# Altium schematic sheet main.SchDoc: 13.56MHz AM-transmitter
size A4; Engineer: CT; SheetNumber: 1; SheetTotal: 2
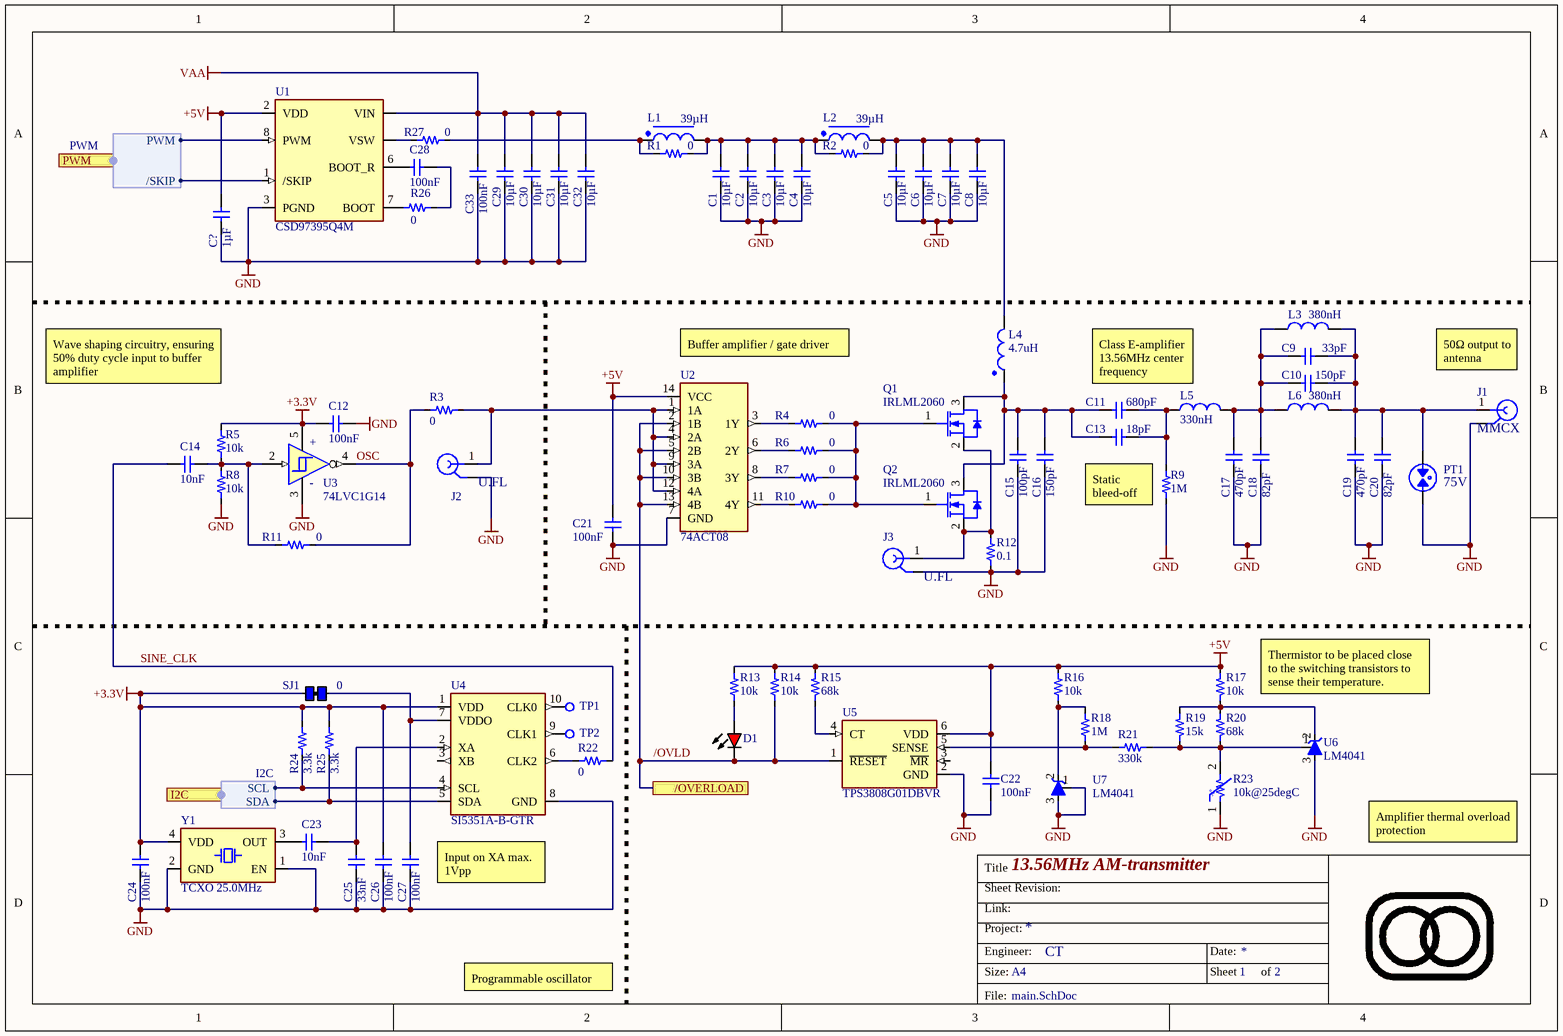
[diagram p0: main.SchDoc]

## Parts
C1  value 10µF  [WCAP-CSGP_1210_L3.2W2.5H2.5]  (hidden comment: Capacitor 10µF +/-10% 50V X7R 1210)
C2  value 10µF  [WCAP-CSGP_1210_L3.2W2.5H2.5]  (hidden comment: Capacitor 10µF +/-10% 50V X7R 1210)
C3  value 10µF  [WCAP-CSGP_1210_L3.2W2.5H2.5]  (hidden comment: Capacitor 10µF +/-10% 50V X7R 1210)
C4  value 10µF  [WCAP-CSGP_1210_L3.2W2.5H2.5]  (hidden comment: Capacitor 10µF +/-10% 50V X7R 1210)
C5  value 10µF  [WCAP-CSGP_1210_L3.2W2.5H2.5]  (hidden comment: Capacitor 10µF +/-10% 50V X7R 1210)
C6  value 10µF  [WCAP-CSGP_1210_L3.2W2.5H2.5]  (hidden comment: Capacitor 10µF +/-10% 50V X7R 1210)
C7  value 10µF  [WCAP-CSGP_1210_L3.2W2.5H2.5]  (hidden comment: Capacitor 10µF +/-10% 50V X7R 1210)
C8  value 10µF  [WCAP-CSGP_1210_L3.2W2.5H2.5]  (hidden comment: Capacitor 10µF +/-10% 50V X7R 1210)
C9  value 33pF  [1206-C-L]  (hidden comment: Capacitor 33pF +/-5% 50V NP0 1206)
C10  value 150pF  [1206-C-N]  (hidden comment: Capacitor 150pF +/-5% 100V NP0 1206)
C11  value 680pF  [1206-C-L]  (hidden comment: Capacitor 680pF +/-5% 100V NP0 1206)
C12  value 100nF  [0603-C-N]  (hidden comment: Capacitor 100nF +/-10% 50V X7R 0603)
C13  value 18pF  [1206-C-N]  (hidden comment: CC1206JKNPOCBN180)
C14  value 10nF  [0603-C-N]  (hidden comment: Capacitor 10nF 50V NP0 0603)
C15  value 100pF  [1206-C-N]  (hidden comment: Capacitor 100pF +/-5% 630V NP0 Class I 1206)
C16  value 150pF  [1206-C-N]  (hidden comment: Capacitor 150pF +/-5% 100V NP0 1206)
C17  value 470pF  [1206-C-L]  (hidden comment: Capacitor 470pF +/-5% 100V NP0 1206)
C18  value 82pF  [1206-C-N]  (hidden comment: 1206N820J102CT)
C19  value 470pF  [1206-C-L]  (hidden comment: Capacitor 470pF +/-5% 100V NP0 1206)
C20  value 82pF  [1206-C-N]  (hidden comment: 1206N820J102CT)
C21  value 100nF  [0603-C-N]  (hidden comment: Capacitor 100nF +/-10% 50V X7R 0603)
C22  value 100nF  [0603-C-N]  (hidden comment: Capacitor 100nF +/-10% 50V X7R 0603)
C23  value 10nF  [0603-C-N]  (hidden comment: Capacitor 10nF 50V NP0 0603)
C24  value 100nF  [0603-C-N]  (hidden comment: Capacitor 100nF +/-10% 50V X7R 0603)
C25  value 33nF  [1206-C-L]  (hidden comment: Capacitor 33nF +/-5% 10V NP0 1206)
C26  value 100nF  [0603-C-N]  (hidden comment: Capacitor 100nF +/-10% 50V X7R 0603)
C27  value 100nF  [0603-C-N]  (hidden comment: Capacitor 100nF +/-10% 50V X7R 0603)
C28  value 100nF  [0603-C-N]  (hidden comment: Capacitor 100nF +/-10% 50V X7R 0603)
C29  value 10µF  [WCAP-CSGP_1210_L3.2W2.5H2.5]  (hidden comment: Capacitor 10µF +/-10% 50V X7R 1210)
C30  value 10µF  [WCAP-CSGP_1210_L3.2W2.5H2.5]  (hidden comment: Capacitor 10µF +/-10% 50V X7R 1210)
C31  value 10µF  [WCAP-CSGP_1210_L3.2W2.5H2.5]  (hidden comment: Capacitor 10µF +/-10% 50V X7R 1210)
C32  value 10µF  [WCAP-CSGP_1210_L3.2W2.5H2.5]  (hidden comment: Capacitor 10µF +/-10% 50V X7R 1210)
C33  value 100nF  [0603-C-N]  (hidden comment: Capacitor 100nF +/-10% 50V X7R 0603)
C?  value 1µF  [1206-C-N]  (hidden comment: Capacitor 1µF +/-10% 50V X7R 1206)
D1  150060RS86000  [WL-SMCW_0603_150060xx8x000]  (value not drawn)
J1  66011002111501  [66011002111501]  (value not drawn)
J2  U.FL-R-SMT(10)  [HRS-U.FL-R-SMT_V]  (value not drawn)
J3  U.FL-R-SMT(10)  [HRS-U.FL-R-SMT_V]  (value not drawn)
L1  Inductance: 39µH  [WE-PD2_1054]  (hidden comment: 744776139)
L2  Inductance: 39µH  [WE-PD2_1054]  (hidden comment: 744776139)
L3  Inductance: 380nH  [WE-CAIR_5910]  (hidden comment: 744918238)
L4  Inductance: 4.7uH  [WE-PDA_1260]  (hidden comment: 784771047)
L5  value 330nH  [IND_2929SQ-331]  (hidden comment: 2929SQ-331GEC)
L6  Inductance: 380nH  [WE-CAIR_5910]  (hidden comment: 744918238)
PT1  GTCC23-750M-R01-2  [GDT_4532]  (value not drawn)
Q1  value IRLML2060  [SOT-23-3-N]  (hidden comment: IRLML2060TRPBF)
Q2  value IRLML2060  [SOT-23-3-N]  (hidden comment: IRLML2060TRPBF)
R1  value 0  [1206-R-N]  (hidden comment: Jumper 0R <50 mOhm 2A 1206)
R2  value 0  [1206-R-N]  (hidden comment: Jumper 0R <50 mOhm 2A 1206)
R3  value 0  [0603-R-N]  (hidden comment: Jumper 0R <50 mOhm 1A 0603)
R4  value 0  [0603-R-N]  (hidden comment: Jumper 0R <50 mOhm 1A 0603)
R5  value 10k  [0603-R-N]  (hidden comment: Resistor 10k +/-1% 50V 0603)
R6  value 0  [0603-R-N]  (hidden comment: Jumper 0R <50 mOhm 1A 0603)
R7  value 0  [0603-R-N]  (hidden comment: Jumper 0R <50 mOhm 1A 0603)
R8  value 10k  [0603-R-N]  (hidden comment: Resistor 10k +/-1% 50V 0603)
R9  value 1M  [1206-R-N]  (hidden comment: CRG1206F1M0)
R10  value 0  [0603-R-N]  (hidden comment: Jumper 0R <50 mOhm 1A 0603)
R11  value 0  [0603-R-N]  (hidden comment: Jumper 0R <50 mOhm 1A 0603)
R12  value 0.1  [1206-R-N]  (hidden comment: Resistor 0.1R +/-1% 0.5W 1206)
R13  value 10k  [0603-R-N]  (hidden comment: Resistor 10k +/-1% 50V 0603)
R14  value 10k  [0603-R-N]  (hidden comment: Resistor 10k +/-1% 50V 0603)
R15  value 68k  [0603-R-N]  (hidden comment: Resistor 68k +/-1% 50V 0603)
R16  value 10k  [0603-R-N]  (hidden comment: Resistor 10k +/-1% 50V 0603)
R17  value 10k  [0603-R-N]  (hidden comment: Resistor 10k +/-1% 50V 0603)
R18  value 1M  [0603-R-N]  (hidden comment: Resistor 1M +/-1% 50V 0603)
R19  value 15k  [0603-R-N]  (hidden comment: Resistor 15k +/-1% 50V 0603)
R20  value 68k  [0603-R-N]  (hidden comment: Resistor 68k +/-1% 50V 0603)
R21  value 330k  [0603-R-N]  (hidden comment: Resistor 330k +/-1% 50V 0603)
R22  value 0  [0603-R-N]  (hidden comment: Jumper 0R <50 mOhm 1A 0603)
R23  value 10k@25degC  [0603-R-N]  (hidden comment: NCP18XH103F03RB)
R24  value 3.3k  [0603-R-N]  (hidden comment: Resistor 3.3k +/-1% 50V 0603)
R25  value 3.3k  [0603-R-N]  (hidden comment: Resistor 3.3k +/-1% 50V 0603)
R26  value 0  [0603-R-N]  (hidden comment: Jumper 0R <50 mOhm 1A 0603)
R27  value 0  [1206-R-N]  (hidden comment: Jumper 0R <50 mOhm 2A 1206)
SJ1  value 0  [SJ_0603_1A]  (hidden comment: SJ-0603-1A)  (net tie, no BOM)
TP1  Testpad with multiple sizes  [TP_1.5mm]  (value not drawn)  (no BOM)
TP2  Testpad with multiple sizes  [TP_1.5mm]  (value not drawn)  (no BOM)
U1  CSD97395Q4M  [SON40P350X450X100-8N]
U2  value 74ACT08  [SOIC14-N]  (hidden comment: MC74ACT08DR2G)
U3  value 74LVC1G14  [SOT25-N]  (hidden comment: SN74LVC1G14DBVR)
U4  SI5351A-B-GTR  [VSSOP10-N]
U5  TPS3808G01DBVR  [SOT-23-6]
U6  value LM4041  [SOT-23-3-N]  (hidden comment: LM4041DIM3X-ADJ/NOPB)
U7  value LM4041  [SOT-23-3-N]  (hidden comment: LM4041DIM3X-ADJ/NOPB)
Y1  value TCXO 25.0MHz  [WE-SPXO_IQXO-791]  (hidden comment: SX2T25.000B010J020S)

## Ports
/OVERLOAD, I2C (harness I2C), PWM (harness PWM)

## Harnesses
I2C: SDA, SCL
PWM: PWM, /SKIP

## Nets
+3.3V: C12.2 C24.1 C26.1 R5.1 R24.2 R25.2 SJ1.1(L) U3.5(VCC) U4.1(VDD) Y1.4(VDD)
+5V: C21.2 C22.2 C?.2 R13.2 R14.2 R15.1 R16.2 R17.2 U1.2(VDD) U2.14(VCC) U5.6(VDD)
GND: C1.1 C2.1 C3.1 C4.1 C5.1 C6.1 C7.1 C8.1 C12.1 C15.1 C16.1 C17.1 C18.1 C19.1 C20.1 C21.1 C22.1 C24.2 C25.1 C26.2 C27.2 C29.1 C30.1 C31.1 C32.1 C33.2 C?.1 J1.2(GND) J2.2(GND) J3.2(GND) PT1.2 R8.2 R9.1 R12.2 R23.1 U1.3(PGND) U2.7(GND) U3.3(GND) U4.8(GND) U5.2(GND) U6.3(A) U7.1(rEF) U7.3(A) Y1.1(EN) Y1.2(GND)
VAA: C29.2 C30.2 C31.2 C32.2 C33.1 U1.5(VIN)
/OVLD: D1.1(K) R14.1 U2.2(1B) U2.5(2B) U2.10(3B) U2.13(4B) U5.1(~{RESET}) ; port /OVERLOAD
OSC: R3.2 R11.2 U3.4(Y)
SINE_CLK: C14.1 R22.1
NetC1_2: C1.2 C2.2 C3.2 C4.2 L1.2 L2.1 R1.2 R2.1
NetC5_2: C5.2 C6.2 C7.2 C8.2 L2.2 L4.2 R2.2
NetC9_1: C9.1 C10.2 C17.2 C18.2 L3.1 L5.2 L6.1
NetC9_2: C9.2 C10.1 C19.2 C20.2 J1.1(SIG) L3.2 L6.2 PT1.1
NetC11_1: C11.1 C13.1 C15.2 C16.2 L4.1 Q1.3(D) Q2.3(D)
NetC11_2: C11.2 C13.2 L5.1 R9.2
NetC14_2: C14.2 R5.2 R8.1 R11.1 U3.2(A)
NetC23_1: C23.1 Y1.3(OUT)
NetC23_2: C23.2 C25.2 U4.2(XA)
NetC27_1: C27.1 SJ1.2(R) U4.7(VDDO)
NetC28_1: C28.1 R26.1
NetC28_2: C28.2 U1.6(BOOT_R)
NetD1_2: D1.2(A) R13.1
NetJ2_1: J2.1(SIG) R3.1 U2.1(1A) U2.4(2A) U2.9(3A) U2.12(4A)
NetJ3_1: J3.1(SIG) Q1.2(S) Q2.2(S) R12.1
NetL1_1: L1.1 R1.1 R27.2
NetQ1_1: Q1.1(G) Q2.1(G) R4.2 R6.2 R7.2 R10.2
NetR4_1: R4.1 U2.3(1Y)
NetR6_1: R6.1 U2.6(2Y)
NetR7_1: R7.1 U2.8(3Y)
NetR10_1: R10.1 U2.11(4Y)
NetR15_2: R15.2 U5.4(CT)
NetR16_1: R16.1 R18.2 U7.2(C)
NetR17_1: R17.1 R19.2 R20.2 U6.2(C)
NetR18_1: R18.1 R21.1 U5.5(SENSE)
NetR19_1: R19.1 R20.1 R21.2 R23.2 U6.1(rEF)
NetR22_2: R22.2 U4.6(CLK2)
NetR24_1: R24.1 U4.4(SCL) ; port I2C.SCL
NetR25_1: R25.1 U4.5(SDA) ; port I2C.SDA
NetR26_2: R26.2 U1.7(BOOT)
NetR27_1: R27.1 U1.4(VSW)
NetTP1_1: TP1.1(Pad) U4.10(CLK0)
NetTP2_1: TP2.1(Pad) U4.9(CLK1)
NetU1_1: U1.1(/SKIP) ; port PWM./SKIP
NetU1_8: U1.8(PWM) ; port PWM.PWM

Not connected (* = marked no-connect by the designer): U4 3(XB); U5 3(~{MR})

## Notes on the sheet
- (near R5) Wave shaping circuitry, ensuring 50% duty cycle input to buffer amplifier
- (near U2) Buffer amplifier / gate driver
- Class E-amplifier
  13.56MHz center frequency
- (near J1) 50Ω output to antenna
- (near R9) Static bleed-off
- Thermistor to be placed close  to the switching transistors to sense their temperature.
- Amplifier thermal overload protection
- Input on XA max. 1Vpp
- Programmable oscillator
- Title
- Sheet Revision:
- Link:
- Size:
- Project:
- Engineer:
- A4
- Date:
- Sheet
- of
- File:
- (in symbol CMP-010-00032-13) -t°
- (in symbol CMP-016-00025-4) +; -

## Library data of the parts
C1-C8 C29-C32 = CMP-072-000922-14: WCAP-CSGP Multilayer Ceramic Chip Capacitor, General Purpose, size 1210, X7R, 10µF, 50VDC; Tolerance: 10%; Technical Reference: X7R1210106K050DFCT10000; Insulation Resistance: 0.01GO; Capacitor Type: MLCC; ComponentLink2URL: https://www.we-online.com/redexpert/spec/885012209073?ad; ComponentLink1URL: https://www.we-online.com/redexpert/article/885012209073?ad; Source: WCAP-CSGP.SchLib; Case/Package: 1210; Packaging: Tape and Reel; ComponentLink1Description: Website Link; Pins: 2; Width: 2.5mm; Voltage Rating: 50V; ComponentLink2Description: Datasheet Link; Match Code: WCAP-CSGP; Max Operating Temperature: 125°C; Usage: General Purpose; JLCPCB Part #: C2918502; Height: 2.5mm; Dielectric: X7R; Dissipation Factor: 10%; Length: 3.2mm; Min Operating Temperature: -55°C; Design Item ID: 885012209073; Mounting Technology: SMT
C9 = CMP-072-000282-13: WCAP-CSGP Multilayer Ceramic Chip Capacitor, General Purpose, size 1206, NP0, 33pF, 50VDC; Insulation Resistance: 10GO; Q Factor: 1000; Tolerance: 5%; Technical Reference: NP01206330J050DFCT10000; Capacitor Type: MLCC; Pins: 2; Length: 3.2mm; Usage: General Purpose; ComponentLink2Description: Datasheet Link; ComponentLink2URL: https://www.we-online.com/redexpert/spec/885012008040?ad; Design Item ID: 885012008040; Match Code: WCAP-CSGP; Width: 1.6mm; Max Operating Temperature: 125°C; Packaging: Tape and Reel; Voltage Rating: 50V; Min Operating Temperature: -55°C; Mounting Technology: SMT; Height: 0.8mm; Dielectric: NP0; Source: WCAP-CSGP.SchLib; Case/Package: 1206; ComponentLink1Description: Website Link; ComponentLink1URL: https://www.we-online.com/redexpert/article/885012008040?ad
C10 C16 = CMP-072-000302-14: WCAP-CSGP Multilayer Ceramic Chip Capacitor, General Purpose, size 1206, NP0, 150pF, 100VDC; Q Factor: 1000; Insulation Resistance: 10GO; Capacitor Type: MLCC; Tolerance: 5%; Technical Reference: NP01206151J100DFCT10000; Packaging: Tape and Reel; Dielectric: NP0; Voltage Rating: 100V; Min Operating Temperature: -55°C; ComponentLink1URL: https://www.we-online.com/redexpert/article/885012008068?ad; Length: 3.2mm; Source: WCAP-CSGP.SchLib; ComponentLink1Description: Website Link; Design Item ID: 885012008068; Mounting Technology: SMT; Pins: 2; Max Operating Temperature: 125°C; JLCPCB Part #: C162445; Height: 0.8mm; Usage: General Purpose; ComponentLink2Description: Datasheet Link; Width: 1.6mm; ComponentLink2URL: https://www.we-online.com/redexpert/spec/885012008068?ad; Match Code: WCAP-CSGP; Case/Package: 1206
C11 = CMP-072-000305-14: WCAP-CSGP Multilayer Ceramic Chip Capacitor, General Purpose, size 1206, NP0, 680pF, 100VDC; Technical Reference: NP01206681J100DFCT10000; Tolerance: 5%; Insulation Resistance: 10GO; Capacitor Type: MLCC; Q Factor: 1000; Mounting Technology: SMT; Case/Package: 1206; Min Operating Temperature: -55°C; Packaging: Tape and Reel; ComponentLink1URL: https://www.we-online.com/redexpert/article/885012008072?ad; ComponentLink1Description: Website Link; Pins: 2; ComponentLink2Description: Datasheet Link; Max Operating Temperature: 125°C; Width: 1.6mm; Design Item ID: 885012008072; Source: WCAP-CSGP.SchLib; Height: 0.8mm; Match Code: WCAP-CSGP; Usage: General Purpose; Voltage Rating: 100V; Dielectric: NP0; Length: 3.2mm; ComponentLink2URL: https://www.we-online.com/redexpert/spec/885012008072?ad; JLCPCB Part #: C541497
C12 C21 C22 C24 C26-C28 C33 = CMP-072-000619-14: WCAP-CSGP Multilayer Ceramic Chip Capacitor, General Purpose, size 0603, X7R, 100nF, 50VDC; Dissipation Factor: 3%; Tolerance: 10%; Capacitor Type: MLCC; Insulation Resistance: 5GO; Technical Reference: X7R0603104K050DFCT10000; ComponentLink2Description: Datasheet Link; Dielectric: X7R; ComponentLink2URL: https://www.we-online.com/redexpert/spec/885012206095?ad; Case/Package: 0603; Voltage Rating: 50V; Height: 0.8mm; JLCPCB Part #: C14663; Design Item ID: 885012206095; Pins: 2; Min Operating Temperature: -55°C; Max Operating Temperature: 125°C; Width: 0.8mm; ComponentLink1URL: https://www.we-online.com/redexpert/article/885012206095?ad; Match Code: WCAP-CSGP; Packaging: Tape and Reel; Source: WCAP-CSGP.SchLib; Usage: General Purpose; Length: 1.6mm; ComponentLink1Description: Website Link; Mounting Technology: SMT
C13 = CMP-001-00140-1: Surface Mount Ceramic Multilayer Capacitor 18pF 5% C0G 1kV 1206 Blister T/R; RoHS Compliant: Yes; Min Operating Temperature: -55°C; Width: 0.063inch; Tolerance: 5%; Max Operating Temperature: 125°C; Case/Package: 1206; Thickness: 0.057inch; Voltage Rating: 1kV; Series: CC; Packaging: Tape and Reel; JLCPCB Part #: CC1206JKNPOCBN180; Mounting Technology: Surface Mount; Length: 0.126inch
C14 C23 = CMP-001-00137-5: Multilayer Ceramic Capacitor, Grm Series, 0.01 F, 5%, C0g / Np0, 50 V, 0603 [1608 Metric]; FLIR Part #: YCAM10N-7; Temperature Coefficient: 30ppm/°C; Reach SVHC Compliant: No; Case/Package: 0603; Thickness: 0.035inch; Width: 0.8mm; Case Code (Metric): 1608; Termination: SMD/SMT; Min Operating Temperature: -55°C; Voltage Rating (DC): 50V; Mounting Technology: Surface Mount; Package Quantity: 4000; Depth: 0.8mm; Dielectric: C0G; Packaging: Cut Tape; Voltage: 50V; Max Operating Temperature: 125°C; RoHS Compliant: Yes; Material: Ceramic; Lead Pitch: 0.5mm; Case Code (Imperial): 0603; Tolerance: 5%; Voltage Rating: 50V; Lead Free: Lead Free; Height: 0.8mm; Length: 1.6mm; JLCPCB Part #: C85973; Series: GRM
C15 = CMP-082-000014-11: WCAP-CSMH Multilayer Ceramic Chip Capacitor, Mid and High Voltage, 1206, NP0 Class I, 100pF, 630VDC; Capacitor Type: MLCC; Q Factor: 1000; Tolerance: 5%; Technical Reference: NP01206101J630DFCT10000; Insulation Resistance: 10GOhm; Max Operating Temperature: 125°C; JLCPCB Part #: C9188; Match Code: WCAP-CSMH; Usage: Mid and High Voltage; ComponentLink1URL: https://www.we-online.com/redexpert/article/885342008004?ad; ComponentLink2URL: https://www.we-online.com/redexpert/spec/885342008004?ad; Voltage Rating: 630V; Width: 1.6mm; Pins: 2; ComponentLink2Description: Datasheet; Case/Package: 1206; Design Item ID: 885342008004; ComponentLink1Description: Manufacturer Link; Dielectric: NP0 Class I; Height: 0.8mm; Packaging: Tape and Reel; Mounting Technology: SMT; Length: 3.2mm; Min Operating Temperature: -55°C; Source: WCAP-CSMH.SchLib
C17 C19 = CMP-072-000304-13: WCAP-CSGP Multilayer Ceramic Chip Capacitor, General Purpose, size 1206, NP0, 470pF, 100VDC; Q Factor: 1000; Capacitor Type: MLCC; Insulation Resistance: 10GO; Tolerance: 5%; Technical Reference: NP01206471J100DFCT10000; Usage: General Purpose; Design Item ID: 885012008071; ComponentLink1Description: Website Link; Min Operating Temperature: -55°C; Length: 3.2mm; Mounting Technology: SMT; Width: 1.6mm; Case/Package: 1206; Source: WCAP-CSGP.SchLib; Packaging: Tape and Reel; ComponentLink2URL: https://www.we-online.com/redexpert/spec/885012008071?ad; ComponentLink2Description: Datasheet Link; Max Operating Temperature: 125°C; Pins: 2; Height: 0.8mm; Voltage Rating: 100V; ComponentLink1URL: https://www.we-online.com/redexpert/article/885012008071?ad; Dielectric: NP0; Match Code: WCAP-CSGP
C18 C20 = CMP-001-00141-1: Cap Ceramic 82pF 1000V C0G 5% Pad SMD 1206 125C T/R; Voltage Rating (DC): 1kV; Case Code (Metric): 3216; Case/Package: 1206; RoHS Compliant: Yes; JLCPCB Part #: C396810; Lead Free: Lead Free
C25 = CMP-072-000252-13: WCAP-CSGP Multilayer Ceramic Chip Capacitor, General Purpose, size 1206, NP0, 33nF, 10VDC; Insulation Resistance: 10GO; Q Factor: 1000; Tolerance: 5%; Capacitor Type: MLCC; Technical Reference: NP01206333J010DFCT10000; Min Operating Temperature: -55°C; Case/Package: 1206; Source: WCAP-CSGP.SchLib; Voltage Rating: 10V; Pins: 2; Height: 1.6mm; Dielectric: NP0; Width: 1.6mm; ComponentLink1Description: Website Link; Length: 3.2mm; ComponentLink2Description: Datasheet Link; Match Code: WCAP-CSGP; Design Item ID: 885012008010; Mounting Technology: SMT; Max Operating Temperature: 125°C; Packaging: Tape and Reel; ComponentLink1URL: https://www.we-online.com/redexpert/article/885012008010?ad; Usage: General Purpose; ComponentLink2URL: https://www.we-online.com/redexpert/spec/885012008010?ad
C? = CMP-072-000852-14: WCAP-CSGP Multilayer Ceramic Chip Capacitor, General Purpose, size 1206, X7R, 1µF, 50VDC; Dissipation Factor: 3%; Tolerance: 10%; Technical Reference: X7R1206105K050DFCT10000; Insulation Resistance: 0.5GO; Capacitor Type: MLCC; Mounting Technology: SMT; ComponentLink2Description: Datasheet Link; Width: 1.6mm; Length: 3.2mm; Match Code: WCAP-CSGP; Voltage Rating: 50V; Packaging: Tape and Reel; ComponentLink1Description: Website Link; ComponentLink2URL: https://www.we-online.com/redexpert/spec/885012208093?ad; Pins: 2; Height: 1.6mm; Max Operating Temperature: 125°C; Min Operating Temperature: -55°C; Dielectric: X7R; Design Item ID: 885012208093; Source: WCAP-CSGP.SchLib; Usage: General Purpose; JLCPCB Part #: C1848; Case/Package: 1206; ComponentLink1URL: https://www.we-online.com/redexpert/article/885012208093?ad
D1 = CMP-002-001080-9: WL-SMCW Mono-color Chip LED Waterclear, size 0603, Red, 2V, 60°; Manufacturer: Wurth Elektronik; Case/Size Code: 0603; Dominant Wavelength: 624nm; Peak Wavelength: 632nm; Luminous Intensity: 800mcd; Chip Technology: AlInGaP; Match Code: WL-SMCW; Source: WL-SMCW.SchLib; Length: 1.6mm; Height: 0.95mm; Emitting Color: Red; Forward Voltage: 2V; ComponentLink1URL: https://www.we-online.com/redexpert/article/150060RS86000?ad; Operating Temperature Min: -40°C; Mount: Surface Mount; Pin Count: 2; Design Item ID: 150060RS86000; ComponentLink1Description: Website Link; Packaging: Tape and Reel; ComponentLink2URL: https://www.we-online.com/redexpert/spec/150060RS86000?ad; JLCPCB Part #: C5875741; Operating Temperature Max: 85°C; Manufacturer Part Number: 150060RS86000; ComponentLink2Description: Datasheet Link; Viewing Angle: 60°; Category: Signal LEDs; Component Type: Standard; Width: 0.8mm
J1 = CMP-002-000609-4: WR-MMCX PCB Jack, THT, Right Angle, 6GHz, 50O; pin to pad: 2>2+3+4+5; Manufacturer: Wurth Elektronik; Value: MMCX; Center Contact Diameter: 0.7mm; Interface Type: IEC 61169-52; Category: Coaxial Connectors; Component Type: Standard; ComponentLink1Description: Website Link; ComponentLink1URL: https://www.we-online.com/redexpert/article/66011002111501?ad; Pin Count: 5; Impedance: 50O; ComponentLink2Description: Datasheet Link; Design Item ID: 66011002111501; JLCPCB Part #: C2894793; Operating Temperature Max: 155°C; Length: 6.5mm; Manufacturer Part Number: 66011002111501; Gender: Jack; ComponentLink2URL: https://www.we-online.com/redexpert/spec/66011002111501?ad; Packaging: Tray; Operating Temperature Min: -55°C; Height: 3.8mm; Orientation: Right Angle; Connector Type: MMCX; Width: 3.5mm; Frequency Range: 6GHz; Source: WR-MMCX.SchLib; Match Code: WR-MMCX; Mount: Through Hole
J2 J3 = CMP-002-00035-10: Ultra Small Surface Mount Coaxial Connector, 50 Ohm, -40 to 90 degC, 3-Pin SMD, RoHS, Tape and Reel; pin to pad: 1>3 2>1+2; Manufacturer: Hirose Electric; Resistance: 50Ohm; Connector Type: RF&Coax; Value: U.FL; Package Reference: U.FL-R-SMT; Datasheet Version: Aug-16; Package Description: 3-Pin Surface Mount Device, Body 2.6 x 2.6 mm; Fastening Type: Snap; Datasheet URL: https://www.hirose.com/product/en/download_file/key_name/U.FL/category/Catalog/doc_file_id/31697/?file_category_id=4&item_id=15&is_series=1; Manufacturer URL: https://www.hirose.com; Contact Plating: Gold; Max Operating Temperature: 90°C; Package Quantity: 2500; Impedance: 50Ohm; JLCPCB Part #: C88373; Packaging: TapeandReel; Min Operating Temperature: -40°C; Mounting Technology: SM; RoHS Compliant: True; Contact Material: Brass; Case/Package: U.FL-R-SMT
L1 L2 = CMP-167-000094-2: WE-PD2 SMT Power Inductor, size 1054, 39µH, 1.62A, 0.14O; Manufacturer: Wurth Elektronik; Self Resonant Frequency: 12MHz; Saturation Current: 1.8A; Case/Size Code: 1054; DC Resistance: 0.098O; Width: 9mm; Source: WE-PD2.SchLib; Operating Temperature Max: 125°C; ComponentLink2Description: Datasheet Link; Match Code: WE-PD2; Height: 5.4mm; Category: Unshielded Power Inductors; Operating Temperature Min: -40°C; Mount: Surface Mount; Rated Current: 1.62A; Design Item ID: 744776139; Manufacturer Part Number: 744776139; DC Resistance Max: 0.14O; ComponentLink1URL: https://www.we-online.com/redexpert/article/744776139?ad; JLCPCB Part #: -; Packaging: Tape and Reel; ComponentLink2URL: https://www.we-online.com/redexpert/spec/744776139?ad; Component Type: Standard; Length: 10mm; ComponentLink1Description: Website Link; Pin Count: 2
L3 L6 = CMP-165-000056-2: WE-CAIR SMT Air Coil, size 5910, 380nH, 2.5A, 50mO; Manufacturer: Wurth Elektronik; Inductance Tolerance: 5%; Case/Size Code: 5910; Self Resonant Frequency: 0.59GHz; Q Factor: 100; ComponentLink2Description: Datasheet Link; ComponentLink1URL: https://www.we-online.com/redexpert/article/744918238?ad; ComponentLink1Description: Website Link; Operating Temperature Max: 125°C; Source: WE-CAIR.SchLib; Design Item ID: 744918238; Category: RF Inductors; Mount: Surface Mount; Match Code: WE-CAIR; ComponentLink2URL: https://www.we-online.com/redexpert/spec/744918238?ad; Rated Current: 2.5A; Pin Count: 2; Packaging: Tape and Reel; Manufacturer Part Number: 744918238; Operating Temperature Min: -40°C; Width: 6.35mm; Component Type: Standard; JLCPCB Part #: -; Height: 5.9mm; Length: 10.55mm; DC Resistance Max: 50mO
L4 = CMP-163-000034-2: WE-PDA SMT Shielded Power Inductor, size 1260, 4.7uH, 6.2A, 17.5mOhm; Manufacturer: Wurth Elektronik; DC Resistance: 14.5mOhm; Saturation Current: 8A; Case/Size Code: 1260; Self Resonant Frequency: 49.8MHz; Automotive: Yes; Source: WE-PDA.SchLib; Operating Temperature Max: 125°C; Pin Count: 2; Width: 12mm; Operating Temperature Min: -40°C; Height: 6mm; ComponentLink1Description: Website Link; Category: Power Inductors; Component Type: Standard; Packaging: Tape and Reel; ComponentLink1URL: https://www.we-online.com/redexpert/article/784771047?ad; Rated Current: 6.2A; DC Resistance Max: 17.5mOhm; ComponentLink2URL: https://www.we-online.com/redexpert/spec/784771047?ad; Manufacturer Part Number: 784771047; Design Item ID: 784771047; Length: 12mm; ComponentLink2Description: Datasheet Link; Match Code: WE-PDA; Mount: Surface Mount
L5 = CMP-006-00042-1: RF inductor, air core, 2% tol, SMT, RoHS, halogen-free; Current Rating: 4.7A; Inductance Tolerance: 5%; Self Resonant Frequency: 660MHz; Test Frequency: 50MHz; Q Factor: 180; Series: 2929SQ; Tolerance: 2%; JLCPCB Part #: C20623511; RoHS Compliant: Yes; Reach SVHC Compliant: No; Core Material: Air; Case/Package: SMD/SMT; Max Operating Temperature: 125°C; Height: 7.24mm; Max DC Current: 4.7A; Lead Free: Yes; Termination: SMD/SMT; RMS Current (Irms): 4.7A; Min Operating Temperature: -40°C; Packaging: Tape and Reel; Width: 7.24mm; Length: 14.1mm
PT1 = CMP-142-000015-1: Gas Discharge Tubes - GDTs / Gas Plasma Arrestors 75VDC 2-POLE 600V @1KV/US; Fail Short: No; Value: 75V; Tolerance: 20%; Number of Poles: 2; Case Code (Imperial): 1812; Packaging: Cut Tape; JLCPCB Part #: C9234; Case Code (Metric): 4532; Mounting Technology: Surface Mount; Case/Package: 1812; Lead Free: Lead Free; RoHS Compliant: Yes; Series: GT
Q1 Q2 = CMP-142-000014-2: 60V Single N-Channel HEXFET Power MOSFET in a Micro 3 package, SOT23-3, RoHS; Max Power Dissipation: 1.25W; Turn-On Delay Time: 4.9ns; Threshold Voltage: 2.5V; Recovery Time: 21ns; Drain-source On Resistance-Max: 480MR; Gate to Source Voltage (Vgs): 16V; Continuous Drain Current (ID): 1.2A; Turn-Off Delay Time: 3.7ns; Input Capacitance: 64pF; Drain to Source Voltage (Vdss): 60V; Case/Package: SOT-23; Mounting Technology: Surface Mount; Pins: 3; Width: 1.4mm; Reach SVHC Compliant: No; Lead Free: Lead Free; Height: 1.02mm; Length: 3.04mm; Max Operating Temperature: 150°C; RoHS Compliant: Yes; Min Operating Temperature: -55°C
R1 R2 R27 = CMP-009-00002-23: Chip Jumper, Thick Film, Jumper, 1206, 250mW, 2A, 0 Ohm, <50 mOhm; Elements: 1; Voltage Rating: 200V; Tolerance: 50 mOhm; Pins: 2; Usage: Jumper; Current Rating: 2A; Max Operating Temperature: 155°C; JLCPCB Part #: C17888; Min Operating Temperature: -55°C; Mounting Technology: SMT; RoHS Compliant: True; Resistor Type: Thick Film; Power Rating: 250mW; Case/Package: 1206
R3 R4 R6 R7 R10 R11 R22 R26 = CMP-009-00006-25: Chip Jumper, Thick Film, Jumper, 0603, 100mW, 1A, 0 Ohm, <50 mOhm; FLIR Part #: YRES0E-1; Tolerance: 50 mOhm; Voltage Rating: 75V; Elements: 1; Usage: Jumper; Case/Package: 0603; Power Rating: 100mW; Current Rating: 1A; Min Operating Temperature: -55°C; RoHS Compliant: True; Resistor Type: Thick Film; Max Operating Temperature: 155°C; JLCPCB Part #: C21189; Pins: 2; Mounting Technology: SMT
R5 R8 = CMP-009-00017-27: Chip Resistor, Thick Film, General Purpose, 0603, 100mW, 50V, 10 kOhm, +/-1%; FLIR Part #: YRES10K-1; Tolerance: 1%; Elements: 1; RoHS Compliant: Yes; Mounting Technology: SMT; Pins: 2; Case/Package: 0603; Usage: General Purpose; JLCPCB Part #: C25804; Max Operating Temperature: 155°C; Min Operating Temperature: -55°C; Power Rating: 100mW; Resistor Type: Thick Film; Voltage Rating: 50V
R9 = CMP-009-00382-2: Res Thick Film 1206 1M Ohm 1% 0.25W(1/4W) ±100ppm/C SMD T/R; Number of Resistors: 1; Max Power Dissipation: 250mW; Operating Supply Voltage: 200V; Temperature Coefficient: 100ppm/°C; Min Operating Temperature: -55°C; JLCPCB Part #: C17927; Case Code (Metric): 3216; Case/Package: 1206; Technology: THICK FILM; Case Code (Imperial): 1206; Package Quantity: 5000; Mounting Technology: Surface Mount; Height: 0.55mm; Series: CRG, Neohm; Tolerance: 1%; Number of Terminations: 2; Depth: 1.55mm; Voltage Rating: 200V; Termination: Solder; Weight: 0.000571oz; Width: 1.55mm; Power Rating: 250mW; Resistor Type: Thick Film; Military Standard: Not; Pins: 1206; Packaging: Tape and Reel; RoHS Compliant: Yes; ELV: Compliant; Max Operating Temperature: 125°C; Length: 3.1mm
R12 = CMP-009-00286-9: Res Thick Film 1206 0.1 Ohm 1% 1/2W ±100ppm/°C Molded SMD SMD Paper T/R; FLIR Part #: YRES0E1-3; Max Power Dissipation: 500mW; Usage: General Purpose; Min Operating Temperature: -55°C; Series: CSR; Length: 0.12inch; Contact Plating: Tin,Matte; Case Code (Imperial): 1206; JLCPCB Part #: C346763; Construction: Rectangular; Resistor Type: Thick Film; Depth: 1.55mm; Military Standard: Not; Lead Free: Lead Free; Mounting Technology: Surface Mount; Power Rating: 500mW; Tolerance: 1%; Case Code (Metric): 3216; Temperature Coefficient: 100ppm/°C; Packaging: Tape and Reel; Height: 0.026inch; Number of Terminations: 2; Radiation Hardening: No; RoHS Compliant: Yes; Width: 0.061inch; Case/Package: 1206; Max Operating Temperature: 155°C
R13 R14 R16 R17 = CMP-009-00017-27: Chip Resistor, Thick Film, General Purpose, 0603, 100mW, 50V, 10 kOhm, +/-1%; FLIR Part #: YRES10K-1; Elements: 1; Tolerance: 1%; Usage: General Purpose; Voltage Rating: 50V; RoHS Compliant: Yes; JLCPCB Part #: C25804; Power Rating: 100mW; Pins: 2; Min Operating Temperature: -55°C; Resistor Type: Thick Film; Case/Package: 0603; Max Operating Temperature: 155°C; Mounting Technology: SMT
R15 R20 = CMP-009-00207-22: Chip Resistor, Thick Film, General Purpose, 0603, 100mW, 50V, 68 kOhm, +/-1%; Tolerance: 1%; Elements: 1; Usage: General Purpose; Pins: 2; RoHS Compliant: Yes; Power Rating: 100mW; Max Operating Temperature: 155°C; Mounting Technology: SMT; Voltage Rating: 50V; Case/Package: 0603; JLCPCB Part #: C114633; Min Operating Temperature: -55°C; Resistor Type: Thick Film
R18 = CMP-009-00234-17: Chip Resistor, Thick Film, General Purpose, 0603, 100mW, 50V, 1 MOhm, +/-1%; Tolerance: 1%; Elements: 1; RoHS Compliant: Yes; Mounting Technology: SMT; Max Operating Temperature: 155°C; Resistor Type: Thick Film; Usage: General Purpose; Voltage Rating: 50V; Min Operating Temperature: -55°C; Power Rating: 100mW; JLCPCB Part #: C22935; Pins: 2; Case/Package: 0603
R19 = CMP-009-00284-13: Chip Resistor, Thick Film, General Purpose, 0603, 100mW, 50V, 15 kOhm, +/-1%; Elements: 1; Tolerance: 1%; Temperature Coefficient: 100ppm/°C; Features: Moisture Resistant; JLCPCB Part #: C22809; Voltage Rating: 50V; Pins: 2; Power Rating: 100mW; RoHS Compliant: Yes; Min Operating Temperature: -55°C; Max Operating Temperature: 155°C; Mounting Technology: SMT; Case/Package: 0603; Resistor Type: Thick Film; Usage: General Purpose; Lead Free: Lead Free
R21 = CMP-009-00316-10: Chip Resistor, Thick Film, General Purpose, 0603, 100mW, 50V, 330 kOhm, +/-1%; Tolerance: 1%; Elements: 1; Temperature Coefficient: 100ppm/°C; Min Operating Temperature: -55°C; Max Operating Temperature: 155°C; Pins: 2; Voltage Rating: 50V; JLCPCB Part #: C23137; Usage: General Purpose; Power Rating: 100mW; Resistor Type: Thick Film; Case/Package: 0603; Mounting Technology: SMT
R23 = CMP-010-00032-13: Thermistor NTC 10K Ohm 5% 2-Pin 0603 Surface Mount Solder Pad 3450K T/R; Tolerance: 1%; Beta Value: 3428k; Min Operating Temperature (MiOT): -40; Case/Package: 0603; Max Operating Temperature (MaOT): 125; JLCPCB Part #: C13564
R24 R25 = CMP-009-00243-17: Chip Resistor, Thick Film, General Purpose, 0603, 100mW, 50V, 3.3 kOhm, +/-1%; Tolerance: 1%; Elements: 1; Usage: General Purpose; Min Operating Temperature: -55°C; Voltage Rating: 50V; JLCPCB Part #: C22978; Max Operating Temperature: 155°C; Power Rating: 100mW; Resistor Type: Thick Film; RoHS Compliant: Yes; Case/Package: 0603; Mounting Technology: SMT; Pins: 2
SJ1 = CMP-009-00345-4: Solder Jumper, Thick Film, Jumper, 0603, 100mW, 1A, 0 Ohm, <50 mOhm; Voltage Rating: 50V; Elements: 1; Temperature Coefficient: 200ppm/°C; Tolerance: 50 mOhm; Power Rating: 100mW; Pins: 2; JLCPCB Part #: C876125; RoHS Compliant: Yes; Resistor Type: Thick Film; Max Operating Temperature: 155°C; Lead Free: Lead Free; Usage: Jumper; Mounting Technology: SMT; Min Operating Temperature: -55°C; Case/Package: 0603
TP1 TP2 = CMP-027-000000-15: Testpad land; Source: 7c7_Connectors.SchLib; Component Type: Standard; Design Item ID: Testpad; Pin Count: 1
U1 = CMP-024-00004-2: CSD97395Q4M High Frequency Synchronous Buck NexFET Power Stage 8-VSON-CLIP -40 to 150; pin to pad: 3>3+9 4>4A+4B+4C+4D+4E+4F 5>5A+5B+5C+5D+5E+5F; Number of Outputs: 1; Min Supply Voltage: 4.5V; Output Current per Channel: 25A; Max Output current: 60A; Max Power Dissipation: 8W; Max Supply Voltage: 5.5V; Interface: PWM; RoHS Compliant: Yes; Lead Free: Contains Lead; Pins: 8; Case/Package: VSON; Min Operating Temperature: -40°C; Series: NexFET™; JLCPCB Part #: C524792; Max Operating Temperature: 150°C; Packaging: Cut Tape; Mounting Technology: Surface Mount
U2 = CMP-016-00026-2: And Gate 4-ELEMENT 2-IN Cmos Automotive 14-PIN SOIC N T/r / IC Gate And 4CH 2-INP 14-SOIC; JLCPCB Part #: C233452; Logic Function: AND GATE
U3 = CMP-016-00025-4: Single 1.65-V to 5.5-V inverter with Schmitt-Trigger inputs 5-SOT-23 -40 to 125; High Level Output Current: -32mA; Max Supply Voltage: 5.5V; Number of Circuits: 1; Output Current: 32mA; Quiescent Current: 10uA; Min Supply Voltage: 1.65V; Input Type: SCHMITT TRIGGER; Turn-On Delay Time: 11ns; Logic Function: Buffer,Inverter,Schmitt Trigger; Propagation Delay: 5ns; Termination: SMD/SMT; Weight: 0.000557oz; Max Operating Temperature: 125°C; RoHS Compliant: Yes; Radiation Hardening: No; Min Operating Temperature: -40°C; JLCPCB Part #: C7835; Mounting Technology: Surface Mount; Package Quantity: 1; Series: 74LVC; Number of Gates: 1; Number of Elements: 1; Number of Bits: 1; Reach SVHC Compliant: No; Packaging: Tape and Reel; Pins: 5; Lead Free: Lead Free; Number of Inputs: 1; Low Level Output Current: 32mA; Max Output current: 32mA; Case/Package: SOT-23; Technology: CMOS
U4 = CMP-023-00007-2: IC CLK GENERATOR 160MHZ 10MSOP; Number of Outputs: 3; Operating Supply Voltage: 3.3V; Number of Circuits: 2; PLL: Yes; Clock Frequency: 200MHz; Input: Crystal; Operating Supply Current: 22mA; Max Duty Cycle: 55%; Min Operating Temperature: -40°C; RoHS Compliant: Yes; Pins: 10; Package Quantity: 2500; Series: MultiSynth™; Max Operating Temperature: 85°C; Packaging: Tape and Reel; JLCPCB Part #: C504891; Mounting Technology: Surface Mount; Case/Package: MSOP
U5 = CMP-019-00093-4: Supervisor Open Drain or Open Collector 1 Channel SOT-23-6; JLCPCB Part #: C19653
U6 U7 = CMP-019-00107-1: Fixed & adjustable, 45-µA, precision micropower shunt voltage reference 3-SOT-23 -40 to 85; Reference Type: Shunt,Adjustable; Max Output current: 12mA; Number of Channels: 1; Max Output Voltage: 10V; Cathode Current: 70uA; Temperature Coefficient: 150ppm/°C; Tolerance: 1%; Mounting Technology: Surface Mount; Series: LM4041-N; Package Quantity: 3000; Min Operating Temperature: -40°C; Case/Package: SOT-23; RoHS Compliant: Yes; Output Current: 12mA; Packaging: Tape and Reel; JLCPCB Part #: C2156756; Max Operating Temperature: 125°C; Pins: 3; Radiation Hardening: No; Lead Free: Lead Free; Output Voltage: 10V
Y1 = CMP-002-001569-1: TCXO 25MHz, 3.3V; Frequency Tolerance: 1ppm; JLCPCB Part #: C5180005